# EAGLE design mikrophonie_2023 (EAGLE 9.6.2)

## Sheet 1 of 3
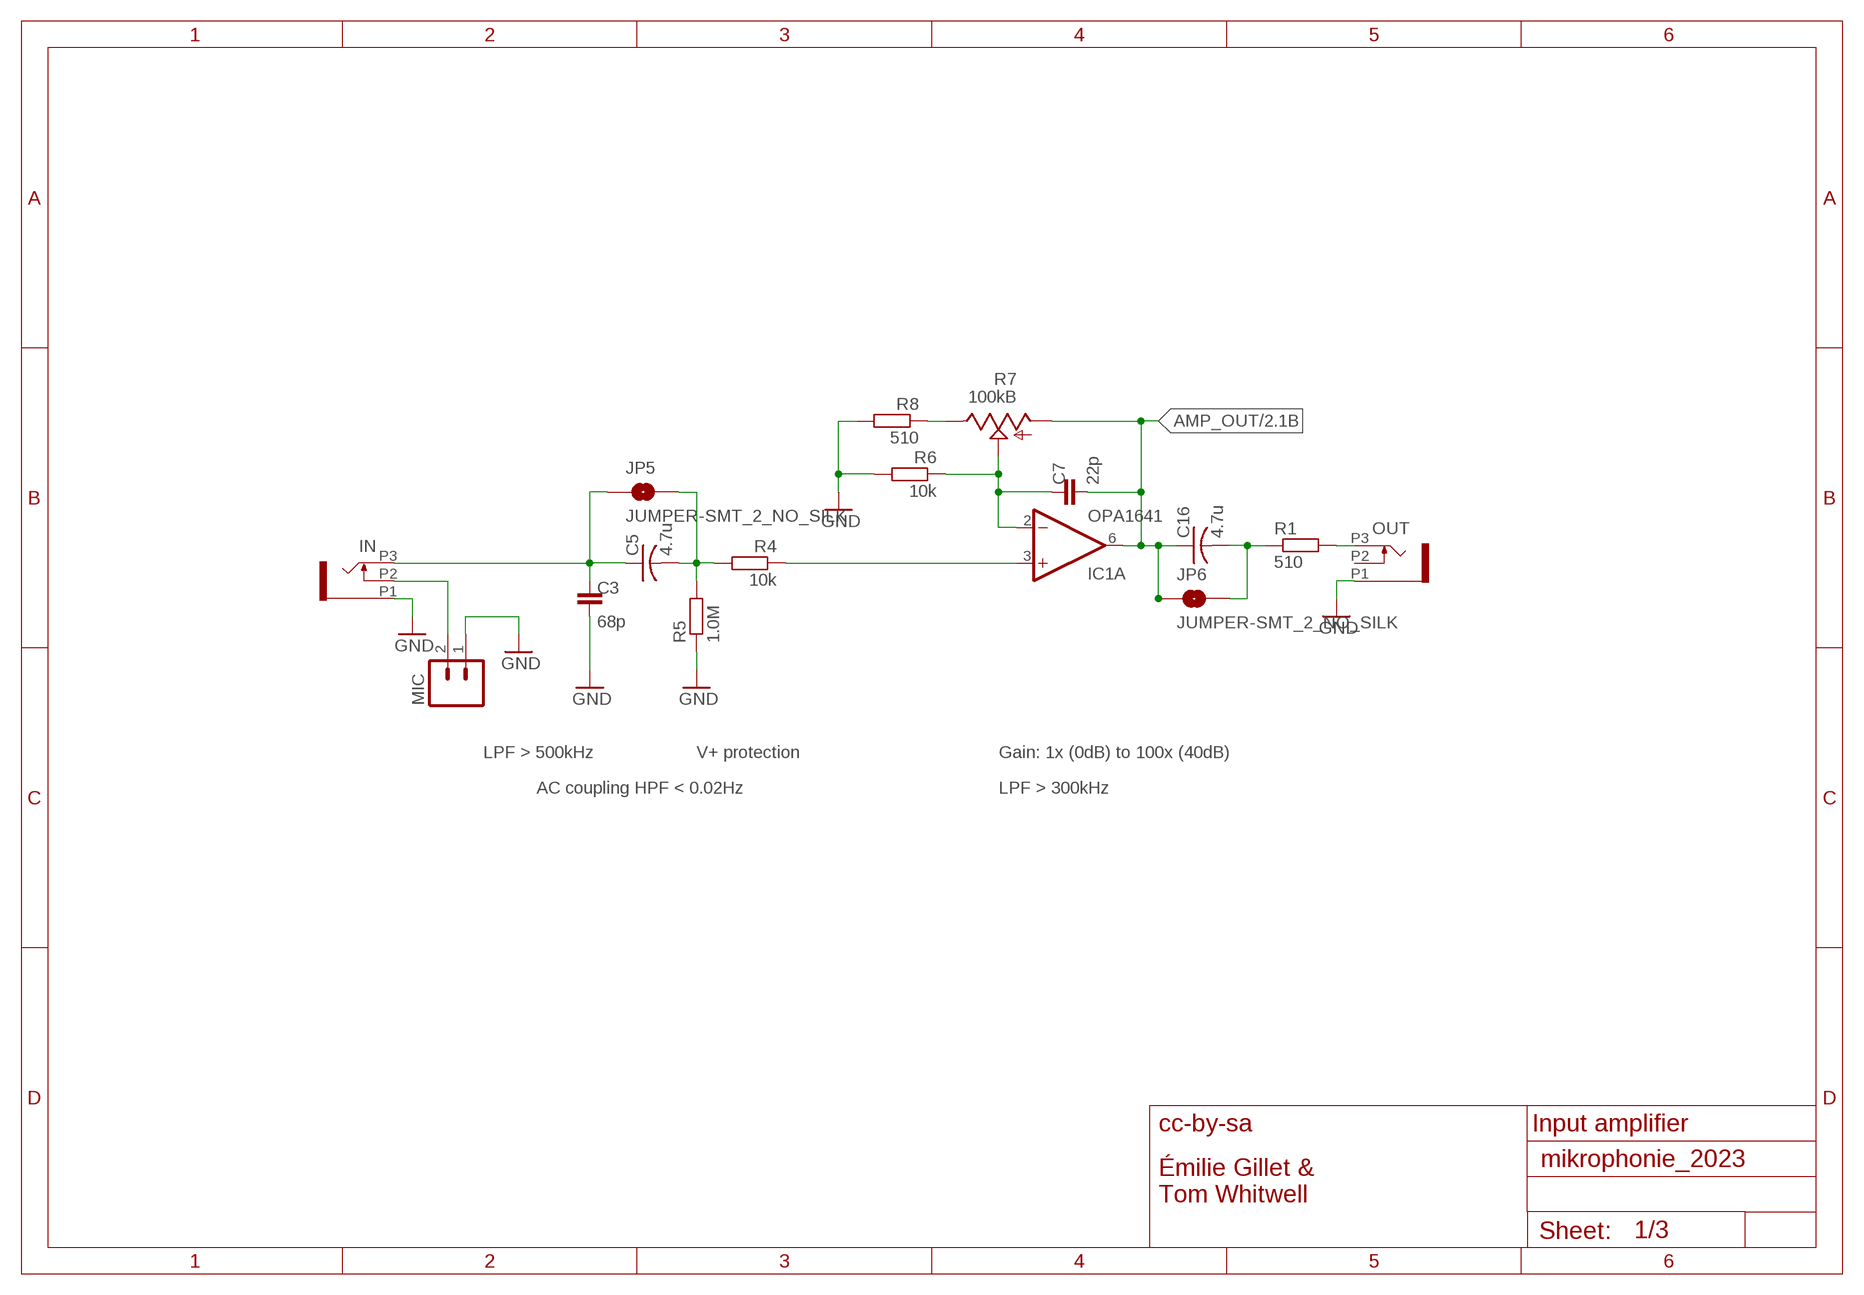
[diagram p0: schematic, sheet 1]

### Parts
C3  68p  CAPACITOR-90  [C0402-90]
C5  4.7u  C-USC0603  [C0603]
C7  22p  CAPACITOR-90  [C0402-90]
C16  4.7u  C-USC0603  [C0603]
IC1  OPA1641  [MSOP8]
IN  PJ301_THONKICONN6  [WQP_PJ_301M6]
JP5  JUMPER-SMT_2_NO_SILK  [SMT-JUMPER_2_NO_SILK]
JP6  JUMPER-SMT_2_NO_SILK  [SMT-JUMPER_2_NO_SILK]
MIC  M02TINY  [1X02_TINY]
OUT  PJ301_THONKICONN6  [WQP_PJ_301M6]
R1  510  RESISTOR-0402_90  [C0402-90]
R4  10k  RESISTOR-0402_90  [C0402-90]
R5  1.0M  RESISTOR-0402_90  [C0402-90]
R6  10k  RESISTOR-0402_90  [C0402-90]
R7  100kB  POT_USVERTICAL_PS  [ALPS_POT_VERTICAL_PS]
R8  510  RESISTOR-0402_90  [C0402-90]

### Nets
AMP_OUT: C7.2 C16.1 IC1.6(A:OUT) JP6.1 R7.P$3(A) ; also sheet 2
GND: C3.2 IN.P1 MIC.1 OUT.P1 R5.1 R6.2 R8.2 ; also sheet 2,3
N$2: IC1.3(A:+IN) R4.1
N$3: OUT.P3 R1.2
N$4: C3.1 C5.1 IN.P3 JP5.1
N$7: IN.P2 MIC.2
N$9: C7.1 IC1.2(A:-IN) R6.1 R7.P$2(S)
N$10: C5.2 JP5.2 R4.2 R5.2
N$13: R7.P$1(E) R8.1
N$15: C16.2 JP6.2 R1.1
Unconnected: OUT.P2

### Notes on the sheet
- LPF > 500kHz | V+ protection | Gain: 1x (0dB) to 100x (40dB)
- AC coupling HPF < 0.02Hz | LPF > 300kHz
- cc-by-sa | Input amplifier
- Émilie Gillet & 
  Tom Whitwell

## Sheet 2 of 3
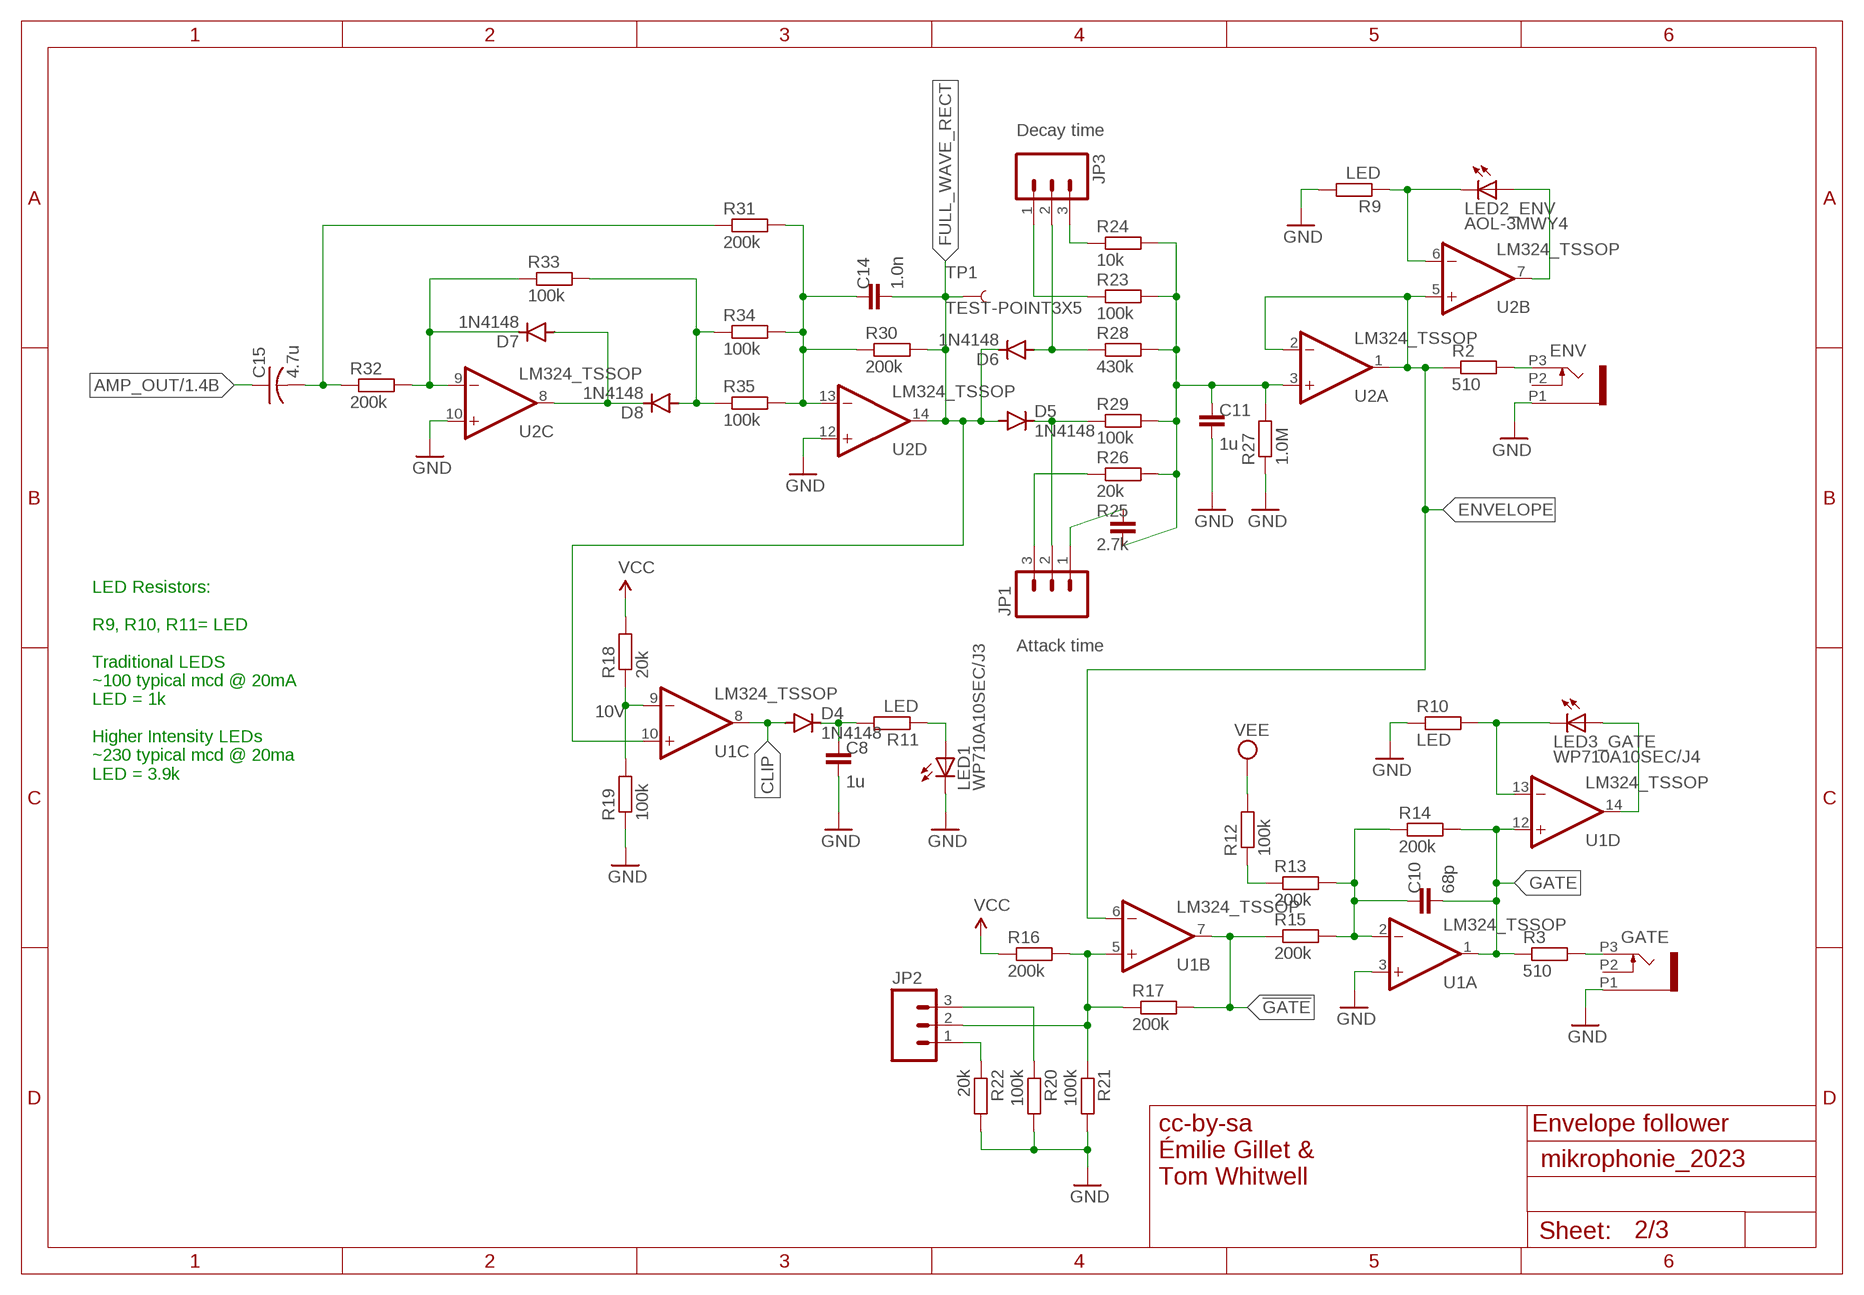
[diagram p1: schematic, sheet 2]

### Parts
C8  1u  CAPACITOR-90  [C0402-90]
C10  68p  CAPACITOR-90  [C0402-90]
C11  1u  CAPACITOR-90  [C0402-90]
C14  1.0n  CAPACITOR-90  [C0402-90]
C15  4.7u  C-USC0603  [C0603]
D4  1N4148  DIODE-SOD523  [SOD523]
D5  1N4148  DIODE-SOD523  [SOD523]
D6  1N4148  DIODE-SOD523  [SOD523]
D7  1N4148  DIODE-SOD523  [SOD523]
D8  1N4148  DIODE-SOD523  [SOD523]
ENV  PJ301_THONKICONN6  [WQP_PJ_301M6]
GATE  PJ301_THONKICONN6  [WQP_PJ_301M6]
JP1  M03PTH  [1X03]
JP2  M03PTH  [1X03]
JP3  M03PTH  [1X03]
LED1  WP710A10SEC/J3  LED3MM  [LED3MM]
LED2_ENV  AOL-3MWY4  LED3MM  [LED3MM]
LED3_GATE  WP710A10SEC/J4  LED3MM  [LED3MM]
R2  510  RESISTOR-0402_90  [C0402-90]
R3  510  RESISTOR-0402_90  [C0402-90]
R9  LED  RESISTOR-0402_90  [C0402-90]
R10  LED  RESISTOR-0402_90  [C0402-90]
R11  LED  RESISTOR-0402_90  [C0402-90]
R12  100k  RESISTOR-0402_90  [C0402-90]
R13  200k  RESISTOR-0402_90  [C0402-90]
R14  200k  RESISTOR-0402_90  [C0402-90]
R15  200k  RESISTOR-0402_90  [C0402-90]
R16  200k  RESISTOR-0402_90  [C0402-90]
R17  200k  RESISTOR-0402_90  [C0402-90]
R18  20k  RESISTOR-0402_90  [C0402-90]
R19  100k  RESISTOR-0402_90  [C0402-90]
R20  100k  RESISTOR-0402_90  [C0402-90]
R21  100k  RESISTOR-0402_90  [C0402-90]
R22  20k  RESISTOR-0402_90  [C0402-90]
R23  100k  RESISTOR-0402_90  [C0402-90]
R24  10k  RESISTOR-0402_90  [C0402-90]
R25  2.7k  CAPACITOR-90  [C0402-90]
R26  20k  RESISTOR-0402_90  [C0402-90]
R27  1.0M  RESISTOR-0402_90  [C0402-90]
R28  430k  RESISTOR-0402_90  [C0402-90]
R29  100k  RESISTOR-0402_90  [C0402-90]
R30  200k  RESISTOR-0402_90  [C0402-90]
R31  200k  RESISTOR-0402_90  [C0402-90]
R32  200k  RESISTOR-0402_90  [C0402-90]
R33  100k  RESISTOR-0402_90  [C0402-90]
R34  100k  RESISTOR-0402_90  [C0402-90]
R35  100k  RESISTOR-0402_90  [C0402-90]
TP1  TEST-POINT3X5  [PAD.03X.05]
U1  LM324_TSSOP  [SOP65P640X120-14N]
U2  LM324_TSSOP  [SOP65P640X120-14N]

### Nets
!GATE: R15.1 R17.2 U1.7(B:OUT)
AMP_OUT: C15.1 ; also sheet 1
AMP_OUT_AC: C15.2 R31.1 R32.1
CLIP: D4.A U1.8(C:OUT)
ENVELOPE: R2.1 U1.6(B:-IN) U2.1(A:OUT) U2.2(A:-IN) U2.5(B:+IN)
FULL_WAVE_RECT: C14.2 D5.A D6.C R30.2 TP1.P$1 U1.10(C:+IN) U2.14(D:OUT)
GATE: C10.2 R3.1 R14.2 U1.1(A:OUT) U1.12(D:+IN)
GND: C8.2 C11.2 ENV.P1 GATE.P1 LED1.K(C) R9.2 R10.1 R19.1 R20.2 R21.2 R22.2 R27.1 U1.3(A:+IN) U2.10(C:+IN) U2.12(D:+IN) ; also sheet 1,3
N$5: D7.A D8.C U2.8(C:OUT)
N$8: C10.1 R13.2 R14.1 R15.2 U1.2(A:-IN)
N$11: D7.C R32.2 R33.1 U2.9(C:-IN)
N$12: D8.A R33.2 R34.1 R35.1
N$14: C14.1 R30.1 R31.2 R34.2 R35.2 U2.13(D:-IN)
N$16: ENV.P3 R2.2
N$17: LED2_ENV.K(C) R9.1 U2.6(B:-IN)
N$18: D5.C JP1.2 R29.1
N$19: C11.1 R23.2 R24.2 R25.2 R26.2 R27.2 R28.2 R29.2 U2.3(A:+IN)
N$21: JP3.3 R24.1
N$23: JP3.1 R23.1
N$24: D6.A JP3.2 R28.1
N$25: JP1.1 R25.1
N$26: JP1.3 R26.1
N$27: R18.1 R19.2 U1.9(C:-IN)
N$28: C8.1 D4.C R11.2
N$30: LED2_ENV.A U2.7(B:OUT)
N$31: LED1.A R11.1
N$32: GATE.P3 R3.2
N$33: JP2.2 R16.2 R17.1 R21.1 U1.5(B:+IN)
N$35: JP2.1 R22.1
N$36: JP2.3 R20.1
N$37: LED3_GATE.K(C) R10.2 U1.13(D:-IN)
N$38: LED3_GATE.A U1.14(D:OUT)
N$39: R12.1 R13.1
VCC: R16.1 R18.2 ; also sheet 3
VEE: R12.2 ; also sheet 3
Unconnected: ENV.P2 GATE.P2

### Notes on the sheet
- Decay time
- LED Resistors: 
  
  R9, R10, R11= LED 
  
  Traditional LEDS
  ~100 typical mcd @ 20mA
  LED = 1k 
  
  Higher Intensity LEDs
  ~230 typical mcd @ 20ma
  LED = 3.9k
- Attack time
- 10V
- cc-by-sa | Envelope follower
- Émilie Gillet & 
  Tom Whitwell

## Sheet 3 of 3
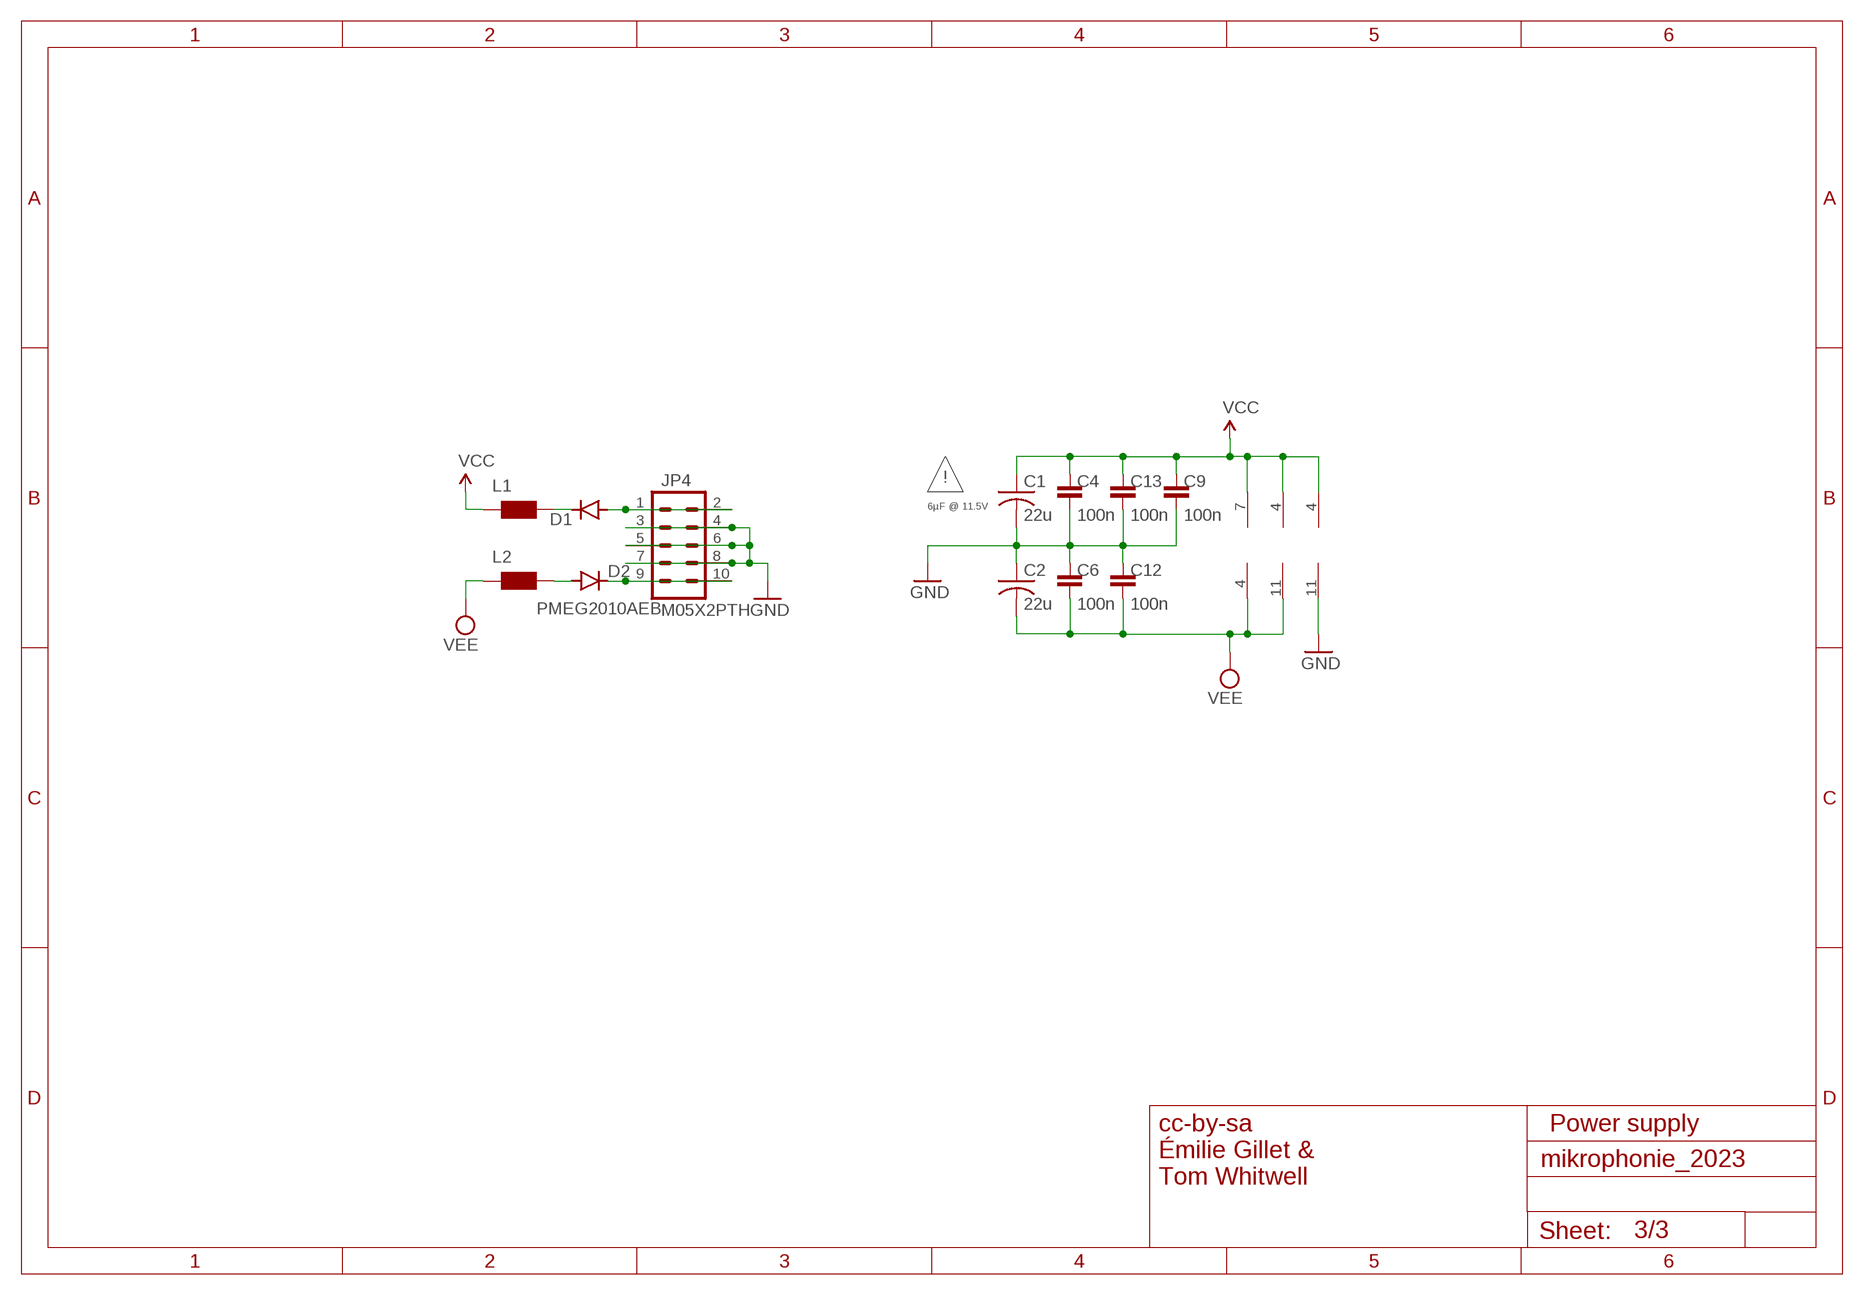
[diagram p2: schematic, sheet 3]

### Parts
C1  22u  C-USC1206  [C1206]
C2  22u  C-USC1206  [C1206]
C4  100n  CAPACITOR-90  [C0402-90]
C6  100n  CAPACITOR-90  [C0402-90]
C9  100n  CAPACITOR-90  [C0402-90]
C12  100n  CAPACITOR-90  [C0402-90]
C13  100n  CAPACITOR-90  [C0402-90]
D1  PMEG2010AEB  DIODE-SOD523  [SOD523]
D2  PMEG2010AEB  DIODE-SOD523  [SOD523]
JP4  M05X2PTH  [AVR_ICSP]
L1  WE-CBF_0603  [0603]
L2  WE-CBF_0603  [0603]

### Nets
GND: C1.2 C2.1 C4.2 C6.1 C9.2 C12.1 C13.2 JP4.3 JP4.4 JP4.5 JP4.6 JP4.7 JP4.8 U1.11(PWR:V-) ; also sheet 1,2
N$6: D1.A JP4.1 JP4.2
N$20: D2.C JP4.9 JP4.10
N$22: D1.C L1.2
N$44: D2.A L2.2
VCC: C1.1 C4.1 C9.1 C13.1 IC1.7(V+) L1.1 U1.4(PWR:V+) U2.4(PWR:V+) ; also sheet 2
VEE: C2.2 C6.2 C12.2 IC1.4(V-) L2.1 U2.11(PWR:V-) ; also sheet 2

### Notes on the sheet
- !
- 6µF @ 11.5V
- cc-by-sa | Power supply
- Émilie Gillet & 
  Tom Whitwell

## Library data of the parts
C1 C2 C5 C15 C16 = rcl:C-US: CAPACITOR, American symbol
C3 C4 C6-C14 R25 = we-rcl:CAPACITOR-90
D1 D2 D4-D8 = diode:DIODE-: DIODE
ENV GATE IN OUT = og-pj301:PJ301_THONKICONN
IC1 = og-ics:OPA1641
JP1-JP3 = SparkFun:M03: Header 3 Standard 3-pin 0.1" header. Use with straight break away headers (SKU : PRT-00116), right angle break away headers (PRT-00553), swiss pins (PRT-00743), machine pins (PRT-00117), and female headers (PRT-00115). Molex polarized connector foot print use with SKU : PRT-08232 with associated crimp pins and housings.
JP4 = og-header:M05X2: Header 5x2 Standard 10-pin dual row 0.1" header. Commonly used with AVR-ISP. Use with Spark Fun Electronics SKU: PRT-00778
JP5 JP6 = SparkFun-Jumpers:JUMPER-SMT_2_NO: Normally open jumper This jumper has two pads in close proximity to each other. Apply solder to close the connection. Round pads are easier to solder for beginners, but are a lot larger. SparkFun Product that uses the round pads: SparkFun EL Sequencer <https://www.sparkfun.com/products/12781>
L1 L2 = wuerth-elektronik:WE-CBF: SMD EMI Suppression Ferrite Beads - excellent anti-EMI properties - low DCR - impedances till 3000 ohms - rated current up to 6 A
LED1 LED2_ENV LED3_GATE = led:LED: LED OSRAM: - CHIPLED LG R971, LG N971, LY N971, LG Q971, LY Q971, LO R971, LY R971 LH N974, LH R974 LS Q976, LO Q976, LY Q976 LO Q996 - Hyper CHIPLED LW Q18S LB Q993, LB Q99A, LB R99A - SideLED LS A670, LO A670, LY A670, LG A670, LP A670 LB A673, LV A673, LT A673, LW A673 LH A674 LY A675 LS A676, LA A676, LO A676, LY A676, LW A676 LS A679, LY A679, LG A679 - Hyper Micro SIDELED® LS Y876, LA Y876, LO Y876, LY Y876 LT Y87S - SmartLED LW L88C, LW L88S LB L89C, LB L89S, LG L890 LS L89K, LO L89K, LY L89K LS L896, LA L896, LO L896, LY L896 - TOPLED LS T670, LO T670, LY T670, LG T670, LP T670 LSG T670, LSP T670, LSY T670, LOP T670, LYG T670 LG T671, LOG T671, LSG T671 LB T673, LV T673, LT T673, LW T673 LH T674 LS T676, LA T676, LO T676, LY T676, LB T676, LH T676, LSB T676, LW T676 LB T67C, LV T67C, LT T67C, LS T67K, LO T67K, LY T67K, LW E67C LS E67B, LA E67B, LO E67B, LY E67B, LB E67C, LV E67C, LT E67C LW T67C LS T679, LY T679, LG T679 LS T770, LO T770, LY T770, LG T770, LP T770 LB T773, LV T773, LT T773, LW T773 LH T774 LS E675, LA E675, LY E675, LS T675 LS T776, LA T776, LO T776, LY T776, LB T776 LHGB T686 LT T68C, LB T68C - Hyper Mini TOPLED® LB M676 - Mini TOPLED Santana® LG M470 LS M47K, LO M47K, LY M47K Source: http://www.osram.convergy.de LUXEON: - LUMILED® LXK2-PW12-R00, LXK2-PW12-S00, LXK2-PW14-U00, LXK2-PW14-V00 LXK2-PM12-R00, LXK2-PM12-S00, LXK2-PM14-U00 LXK2-PE12-Q00, LXK2-PE12-R00, LXK2-PE12-S00, LXK2-PE14-T00, LXK2-PE14-U00 LXK2-PB12-K00, LXK2-PB12-L00, LXK2-PB12-M00, LXK2-PB14-N00, LXK2-PB14-P00, LXK2-PB14-Q00 LXK2-PR12-L00, LXK2-PR12-M00, LXK2-PR14-Q00, LXK2-PR14-R00 LXK2-PD12-Q00, LXK2-PD12-R00, LXK2-PD12-S00 LXK2-PH12-R00, LXK2-PH12-S00 LXK2-PL12-P00, LXK2-PL12-Q00, LXK2-PL12-R00 Source: www.luxeon.com KINGBRIGHT: KA-3528ASYC Source: www.kingbright.com
MIC = og-header:M02: Header 2 Standard 2-pin 0.1" header. Use with straight break away headers (SKU : PRT-00116), right angle break away headers (PRT-00553), swiss pins (PRT-00743), machine pins (PRT-00117), and female headers (PRT-00115). Molex polarized connector foot print use with SKU : PRT-08233 with associated crimp pins and housings.
R1-R6 R8-R24 R26-R35 = we-rcl:RESISTOR: Resistors all kinds in 0402 and 0603
R7 = og-pots:POT_US
TP1 = SparkFun:TEST-POINT
U1 U2 = MTM_untested:LM324_TSSOP: IC OPAMP QUAD 1.8V; MPN: MCP6004-I/ST; OC_FARNELL: 8540861; OC_NEWARK: 72C4277; PACKAGE: 14TSSOP; SUPPLIER: Microchip

## Board
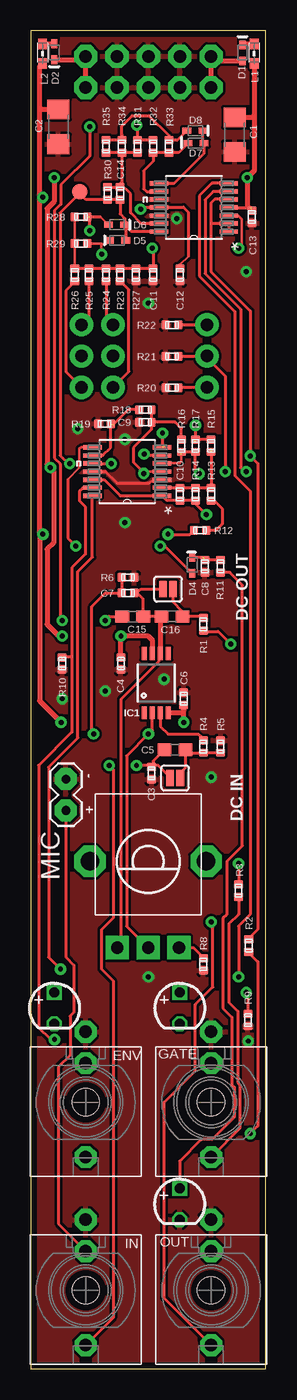
[diagram p3: board, top side]
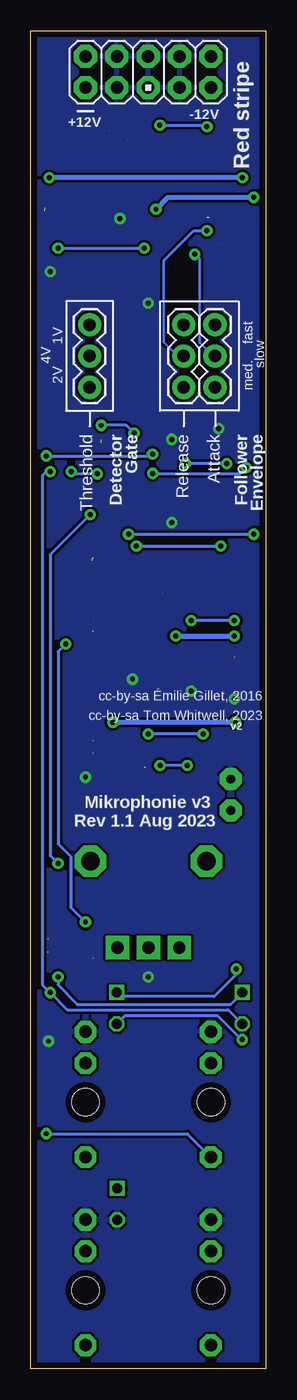
[diagram p4: board, bottom side, seen from below]

Size 19.03 x 108.43 mm. Coordinates in mm from the lower left corner, seen from the top.
Outline: 19.03,108.43 0,108.43 0,0 19.03,0 19.03,108.43
Copper layers (1*16): Top 0.035mm / dielectric 1.5mm / Bottom 0.035mm
Design rules "PCBCart-Standard *": minimum track width 8mil, minimum drill 0.4mm, track to track 8mil, track to pad 8mil, pad to pad 8mil, via to via 8mil, smd to smd 8mil, copper to edge 20mil, drill to drill 8mil, minimum pad ring 8mil, minimum via ring 10mil, stop-mask expansion 3mil, vias tented up to drill 25mil, thermal gap 8mil

### Footprints (pad centres in the part's own frame; a part is rotated, then mirrored left to right if it is on the bottom)
C1206 = smd 1.6 x 1.8: 1 -1.4,0; 2 1.4,0
C0402-90 = smd 0.7 x 0.75: 1 -0.5,0; 2 0.5,0
C0603 = smd 1.1 x 1: 1 -0.85,0; 2 0.85,0
SOD523 = smd 0.7 x 0.5: A 0.7,0; C -0.6,0
WQP_PJ_301M6 = drill 1.016 pad 1.778 octagon: P1 0,-5.715; P2 0,-3.175; P3 0,4.445 | hole 2.2: 0,0
MSOP8 = smd 0.41 x 1.02: 1 -0.975,-2.4; 2 -0.325,-2.4; 3 0.325,-2.4; 4 0.975,-2.4; 5 0.975,2.4; 6 0.325,2.4; 7 -0.325,2.4; 8 -0.975,2.4
1X03 = drill 1.016 pad 1.88: 1 0,0; 2 2.54,0; 3 5.08,0
AVR_ICSP = drill 1.016 pad 1.88 octagon: 1 -1.27,5.08; 2 1.27,5.08; 3 -1.27,2.54; 4 1.27,2.54; 5 -1.27,0; 6 1.27,0; 7 -1.27,-2.54; 8 1.27,-2.54; 9 -1.27,-5.08; 10 1.27,-5.08
SMT-JUMPER_2_NO_SILK = smd 0.635 x 1.27: 1 -0.406,0; 2 0.406,0
0603 = smd 0.85 x 0.7: 1 -0.9,0; 2 0.7,0
LED3MM = drill 0.813 square: A -1.27,0 | drill 0.813 octagon: K 1.27,0
1X02_TINY = drill 0.7 pad 1.778 octagon: 1 0,0; 2 2.54,0
ALPS_POT_VERTICAL_PS = drill 1 pad 1.88 square: P$1 -2.5,7; P$2 0,7; P$3 2.5,7 | drill 1.5 pad 2.54 octagon: P$4 -4.7,0; P$5 4.7,0
PAD.03X.05 = smd 1.27 x 1.27: P$1 0,0
SOP65P640X120-14N = smd 1.473 x 0.356: 1 -2.819,1.956; 2 -2.819,1.295; 3 -2.819,0.66; 4 -2.819,0; 5 -2.819,-0.66; 6 -2.819,-1.295; 7 -2.819,-1.956; 8 2.819,-1.956; 9 2.819,-1.295; 10 2.819,-0.66; 11 2.819,0; 12 2.819,0.66; 13 2.819,1.295; 14 2.819,1.956

### Placement (x,y rotation side)
C1  16.51,100.01 270 top
C2  2.22,100.65 90 top
C3  9.78,48.26 270 top
C4  7.3,57.15 270 top
C5  11.68,50.16 0 top
C6  12.38,54.29 270 top
C7  7.87,62.87 0 top
C8  14.1,65.02 270 top
C9  9.27,76.71 180 top
C10  12.06,70.87 270 top
C11  9.91,88.65 270 top
C12  12.06,88.65 90 top
C13  17.91,93.34 270 top
C14  7.24,95.25 270 top
C15  8.26,60.96 180 top
C16  11.43,60.96 0 top
D1  17.14,106.68 270 top
D2  1.91,106.68 90 top
D4  13.08,65.15 270 top
D5  6.99,91.44 0 top
D6  6.99,92.71 180 top
D7  13.34,99.31 0 top
D8  13.34,100.33 180 top
ENV  4.45,21.59 180 top
GATE  14.61,21.59 180 top
IC1  10.16,55.56 0 top
IN  4.45,6.35 180 top
JP1  4.11,84.61 270 bottom
JP2  14.27,84.61 270 bottom
JP3  6.65,79.53 90 bottom
JP4  9.53,105.09 90 bottom
JP5  11.68,47.88 0 top
JP6  11.11,63.18 0 top
L1  18.1,106.68 90 top
L2  0.95,106.68 90 top
LED1  12.04,13.34 270 top
LED2_ENV  1.91,29.21 270 top
LED3_GATE  12.06,29.21 270 top
MIC  2.84,47.78 270 top
OUT  14.61,6.35 180 top
R1  13.97,60.33 270 top
R2  17.65,34.29 270 top
R3  16.83,38.73 270 top
R4  13.97,50.42 270 top
R5  15.37,50.42 270 top
R6  7.87,64.14 0 top
R7  9.51,41.12 180 top
R8  13.97,32.77 270 top
R9  17.59,28.26 270 top
R10  2.54,57.15 90 top
R11  15.37,65.02 90 top
R12  13.72,67.94 180 top
R13  14.61,70.87 90 top
R14  13.34,70.87 270 top
R15  14.61,74.8 270 top
R16  12.19,74.8 270 top
R17  13.34,74.8 90 top
R18  9.27,77.72 0 top
R19  5.97,76.58 0 top
R20  11.43,79.5 180 top
R21  11.43,82.04 180 top
R22  11.43,84.58 180 top
R23  7.24,88.65 90 top
R24  6.1,88.65 90 top
R25  4.7,88.65 90 top
R26  3.56,88.65 90 top
R27  8.51,88.65 90 top
R28  4.06,93.34 180 top
R29  4.06,91.19 180 top
R30  6.22,95.25 270 top
R31  8.64,99.06 270 top
R32  9.91,99.06 270 top
R33  11.18,99.06 90 top
R34  7.37,99.06 270 top
R35  6.1,99.06 270 top
TP1  3.95,95.41 180 top
U1  7.81,72.71 180 top
U2  13.21,94.11 180 top

### Tracks (layer width: path | path; a pad name or v marks a point on that pad's centre or on a via)
!GATE  (via drill 0.4)  (2 unrouted)
  Top 0.203: 10.79,74.68 11.18,74.68 | 13.34,75.31 13.34,75.06
  Top 0.254: R15.1 R17.2 | U1.7 10.67,74.7 v10.67,75.82 | v13.34,76.45 13.34,75.31
  Bottom 0.254: v10.67,75.82 11.3,76.45 v13.34,76.45
AMP_OUT  (1 unrouted)
  Top 0.254: 10.48,60.87 C16.1 C15.1 9.11,62.4 8.62,62.88 | IC1.6 10.37,57.85 10.37,57.32 7.3,54.25 7.3,34.41 R7.P$3 | C7.2 8.62,62.88 | JP6.1 8.9,63.18 8.61,62.89 8.62,62.88
  Top 0.406: 10.48,60.87 IC1.6
AMP_OUT_AC  (via drill 0.4)
  Top 0.254: R32.1 R31.1 8.64,100.71 v8.57,100.78 | v4.76,100.65 4.76,98.28 2.42,95.94 2.42,94.38 1.91,93.86 1.91,73.82 2.37,73.35 2.37,60.81 v2.54,60.64 | v6.03,60.64 6.35,60.96 C15.2
  Bottom 0.254: v8.57,100.78 5.21,100.78 5.08,100.65 v4.76,100.65 | v2.54,60.64 v6.03,60.64
CLIP  (via drill 0.4)
  Top 0.203: 3,72.08 3.94,73.02 3.94,74.55 4.06,74.68 4.98,74.68 U1.8
  Top 0.254: v10.48,66.67 10.86,66.67 D4.A | v3.64,66.67 3,67.32 3,72.08
  Bottom 0.254: v10.48,66.67 v3.64,66.67
ENVELOPE  (via drill 0.4)  (1 unrouted)
  Top 0.254: U2.1 U2.2 14.62,92.81 14.59,92.84 | 17.62,34.83 18.39,35.61 18.39,73.36 v17.78,73.98 17.78,85.72 14.59,88.91 14.59,92.84 | U1.6 9.29,74 v9.17,74.13 | U2.5 14.88,94.77 14.59,94.47 14.59,92.84
  Bottom 0.254: v17.78,73.98 9.32,73.98 v9.17,74.13
FULL_WAVE_RECT  (via drill 0.4)
  Top 0.203: 7.68,92.61 D6.C 7.62,92.75
  Top 0.254: D5.A 7.68,92.61 8.14,92.15 U2.14 | TP1.P$1 3.95,95.26 | 3.95,95.26 2.36,93.67 2.36,74.01 3.03,73.34 v3.16,73.34 | U1.10 6.48,73.37 v6.51,73.34 | 3.95,95.26 4.46,94.75 R30.2 C14.2 7.24,93.6 7.62,93.22 7.62,92.75
  Bottom 0.254: v3.16,73.34 v6.51,73.34
GATE  (via drill 0.4)
  Top 0.254: R14.2 C10.2 11.02,70.37 U1.1 7.23,70.75 5.93,72.05 U1.12 | v16.83,40.96 R3.1 | R14.2 13.34,70.55 | v14.22,69.22 13.34,70.1 R14.2
  Bottom 0.254: v14.22,69.22 17.46,65.98 17.46,41.59 v16.83,40.96
GND  (via drill 0.4)
  Top 0.254: U1.11 6.03,72.71 6.99,71.75 9.59,71.75 9.76,71.92 9.94,71.92 10.07,72.05 U1.3
  other vias: 2.54,54.29 17.46,88.9 3.81,76.2 6.03,54.93 10.79,55.88 14.61,47.94 7.62,68.58 9.53,86.36 17.6,26.54 9.53,31.75 7.62,75.31 11.81,93.22
  pour Bottom: 20.93,0 20.93,108.43 -3.19,108.43 -3.19,0
  pour Top: 20.3,0 20.3,108.43 -1.93,108.43 -1.93,0
N$2  (1 unrouted)
  Top 0.254: 14.01,50.96 13.79,51.18 13.53,51.44 11.11,51.44 10.48,52.06 IC1.3
N$3  (via drill 0.4)  (1 unrouted)
  Top 0.254: 13.97,59.75 15.18,59.75 v16.19,58.74 | OUT.P3 10.79,5.71 10.79,21.59 13.34,24.13 13.34,29.52 14.75,30.93 14.75,36.05 v14.61,36.2
  Bottom 0.254: v16.19,58.74 16.83,58.1 16.83,42.55 15.8,41.52 15.8,37.4 v14.61,36.2
N$4  (via drill 0.4)  (4 unrouted)
  Top 0.254: 11.23,49.77 C5.1 9.91,49.24 9.91,48.92 9.97,48.92 | v6.35,48.9 6.67,48.58 6.67,36.51 5.71,35.56 5.71,32.38 6.67,31.43 6.67,4.13 IN.P3 | 9.93,48.76 C3.1 | 9.63,48.91 C3.1 | 9.79,48.74 9.97,48.92 | 9.97,48.92 10.29,48.92 11.28,47.93 JP5.1 | 9.77,48.76 9.77,48.9 v8.56,48.9
  Bottom 0.254: v6.35,48.9 v8.56,48.9
N$5
  Top 0.254: D8.C 13.94,99.41 D7.A 14.04,98.49 11.59,96.04 11.57,96.06 U2.8
N$6
  Top 0.406: D1.A 14.99,105.98 JP4.2 JP4.1
N$7
  Top 0.254: MIC.2 2.84,33.36 3.49,32.7 3.49,28.89 3.17,28.57 3.17,25.4 2.22,24.45 2.22,11.75 IN.P2
N$8  (2 unrouted)
  Top 0.254: C10.1 R14.1 R13.2 14.61,74.43 | U1.2 12.03,71.41
N$9  (via drill 0.4)
  Top 0.254: v5.08,51.44 4.93,51.58 4.93,61.77 6.03,62.87 C7.1 R6.1 | IC1.2 9.84,51.75 v9.53,51.44 7.76,49.67 7.76,35.86 R7.P$2
  Bottom 0.254: v5.08,51.44 v9.53,51.44
N$10  (1 unrouted)
  Top 0.254: R5.2 R4.2 | 13.97,49.84 12.86,49.84 C5.2 | 12.13,49.77 C5.2 | JP5.2 12.09,48.28 12.53,48.73 C5.2
N$11
  Top 0.254: U2.9 10.36,95.38 9.4,95.38 9.14,95.63 9.14,97.09 9.91,97.85 R32.2 R33.1 11.98,98.56 D7.C
N$12  (2 unrouted)
  Top 0.254: D8.A 12.26,99.96 12.25,99.96 11.85,99.56 R33.2 11.18,99.95 9.57,101.56 8.21,101.56 7.37,100.71 R34.1 | 7.37,100.01 R34.1 | R34.1 R35.1
N$13  (1 unrouted)
  Top 0.254: 14.01,33.3 13.2,34.12 R7.P$1
N$14
  Top 0.254: R31.2 R34.2 | R34.2 R35.2 | C14.1 7.37,95.88 R34.2 | R30.1 C14.1 | C14.1 7.24,96.06 8.08,95.21 8.08,93.68 8.95,92.81 U2.13
N$15  (1 unrouted)
  Top 0.254: R1.1 13.96,60.96 C16.2 12.28,61.38 11.52,62.14 JP6.2
N$16  (via drill 0.4)  (1 unrouted)
  Top 0.254: 17.62,33.75 18.39,32.97 18.39,19.66 v17.78,19.05
  Bottom 0.254: v17.78,19.05 6.35,19.05 ENV.P3
N$17  (via drill 0.4)
  Top 0.254: v17.46,72.71 17.31,72.71 17,73.02 17,85.86 14.11,88.75 14.11,94.74 14.77,95.4 U2.6 | v17.46,30.48 17.59,30.35 R9.1
  Bottom 0.254: v17.46,72.71 17.78,72.71 18.1,72.39 18.1,31.11 v17.46,30.48 16.07,29.08 3.05,29.08 LED2_ENV.K
N$18  (via drill 0.4)
  Top 0.203: D5.C 6.07,91.12 5.71,91.12 | R29.1 5.71,91.19 5.71,91.12 | v5.74,90.31 5.71,90.33 5.71,91.12
  Bottom 0.203: JP1.2 4.28,82.07 5.35,83.15 5.35,89.92 v5.74,90.31
N$19  (via drill 0.4)  (1 unrouted)
  Top 0.203: R28.2 R29.2 | 3.56,91.18 R26.2 | 17.03,93.21 17.07,93.17 17.07,91.05 v16.83,90.81
  Top 0.254: v9.84,90.81 9.91,90.74 C11.1 R27.2 R23.2 R24.2 R25.2 R26.2 | U2.3 16.79,93.45 17.03,93.21
  Bottom 0.254: v16.83,90.81 v9.84,90.81
N$20
  Top 0.406: JP4.9 JP4.10 4.16,106.08 D2.C
N$21
  Top 0.254: JP3.3 6.1,85.17 R24.1
N$22
  Top 0.406: D1.C 17.25,107.38 L1.2
N$23
  Top 0.254: JP3.1 7.94,80.82 7.94,87.45 R23.1
N$24  (via drill 0.4)  (1 unrouted)
  Top 0.203: D6.A 5.65,93.34
  Top 0.254: v4.76,92.23 4.76,93.33 | 5.65,93.34 R28.1
  Bottom 0.203: 8.26,89.79 8.26,83.19 7.14,82.07 JP3.2
  Bottom 0.254: 8.26,89.79 5.81,92.23 v4.76,92.23
N$25
  Top 0.254: R25.1 4.7,85.2 JP1.1
N$26
  Top 0.254: JP1.3 2.84,80.8 2.84,87.36 3.56,88.08 R26.1
N$27  (1 unrouted)
  Top 0.254: U1.9 5.03,74.04 5.84,74.04 6.47,74.67 R19.2 | R18.1 7.87,77.72 6.68,76.53
N$28  (1 unrouted)
  Top 0.254: 13.98,65.75 D4.C | R11.2 C8.1
N$30  (via drill 0.4)
  Top 0.254: v16.83,31.75 16.83,35.88 17.78,36.83 17.78,71.12 16.54,72.36 16.54,85.67 13.65,88.56 13.65,95.06 14.66,96.06 U2.7
  Bottom 0.254: v16.83,31.75 16.83,31.11 15.25,29.54 2.85,29.54 LED2_ENV.A
N$31
  Top 0.254: LED1.A 12.04,16.81 13.82,18.59 14.69,18.59 16.48,20.38 16.48,22.8 16.28,23 16.28,28.49 15.56,29.21 15.56,36.51 15.88,36.83 15.88,41.11 17.14,42.38 17.14,63.5 16.12,64.52 R11.1
N$32
  Top 0.254: R3.2 16.83,36.83 16.04,36.05 16.04,29.68 16.76,28.96 16.76,23.17 16.94,22.99 16.94,19.48 GATE.P3
N$33  (via drill 0.4)  (1 unrouted)
  Top 0.203: U1.5 10.67,73.41 12.06,73.41 12.19,73.53 12.19,74.03
  Top 0.254: R21.1 14.24,82.04 JP2.2 14.27,81.94 15.76,80.44 15.76,72.72 v15.75,72.71 | v13.65,72.53 13.34,72.85 R17.1 R16.2
  Bottom 0.254: v15.75,72.71 15.58,72.53 v13.65,72.53
N$35
  Top 0.254: R22.1 14.24,84.58 JP2.1
N$36
  Top 0.254: R20.1 14.24,79.5 JP2.3
N$37  (via drill 0.4)  (3 unrouted)
  Top 0.254: v1.92,26.67 1.6,26.67 0.64,27.63 0.64,48.9 3.32,51.58 3.32,57.73 | 2.53,57.65 2.53,57.8 | R10.2 2.53,57.78 | 3.32,57.73 3.32,64.92 4.43,66.02 4.43,69.85 3.92,70.35 3.92,71.11 4.19,71.37 4.95,71.37 U1.13 | 2.54,57.73 3.32,57.73
  Bottom 0.254: v1.92,26.67 1.96,26.67 3.87,28.57 11.43,28.57 LED3_GATE.K
N$38  (via drill 0.4)
  Top 0.254: v2.4,32.38 1.45,33.34 1.45,48.76 3.81,51.12 3.81,64.6 4.99,65.78 U1.14
  Bottom 0.254: v2.4,32.38 2.4,31.95 4.19,30.16 11.75,30.16 LED3_GATE.A
N$39
  Top 0.254: R13.1 14.85,70.37 15.49,69.72 15.49,68.45 14.99,67.94 R12.1
N$44
  Top 0.406: L2.2 D2.A
VCC  (via drill 0.4)  (1 unrouted)
  Top 0.203: U1.4 9.29,72.71
  Top 0.254: 9.29,72.71 v9.14,72.56 9.14,72.61 8.3,73.46 8.3,74.64 9.77,76.11 C9.1 | 9.89,77.72 R18.2 | U2.4 17.85,94.11 | R18.2 9.79,77.71 | R18.2 C9.1 | R16.1 12.19,76.2 11.68,76.71 C9.1
  Top 0.406: 1.81,96.52 v1.89,96.52 1.89,94.6 1.32,94.03 1.32,73.29 v1.59,73.03 1.59,72.97 1.84,72.72 1.84,66.93 1.32,66.41 1.32,60.33 2.27,59.37 v2.54,59.37 | C4.1 v7.3,59.37 9.53,59.37 9.84,59.06 IC1.7 | L1.1 18.1,101.6 | 18.1,101.6 18.1,97.08 v17.54,96.52 17.54,94.21 C13.1 | C1.1 17.91,101.41 18.1,101.6
  Bottom 0.254: v9.14,72.56 2.05,72.56 v1.59,73.03
  Bottom 0.406: v1.89,96.52 v17.54,96.52 | v7.3,59.37 v2.54,59.37
VEE  (via drill 0.4)
  Top 0.203: C12.2 12.06,89.47 12.78,90.19
  Top 0.254: 12.78,90.19 12.78,93.71 12.35,94.14 10.42,94.14 U2.11 9.08,94.11 9.05,94.14 v8.89,93.98 | v11.11,67.63 11.13,67.61 12.88,67.61 R12.2 | v0.98,67.63 0.71,67.63
  Top 0.406: 2.41,102.05 C2.2 0.9,102.05 0.71,102.23 | 0.71,94.93 0.71,67.63 0.71,54.12 v2.45,52.39 | 0.71,94.93 v0.96,94.93 | v12.38,52.39 C6.2 12.38,53.32 12.23,53.16 IC1.4 | L2.1 0.71,105.54 0.71,102.23 | 0.71,94.93 0.71,102.23
  Bottom 0.254: v11.11,67.63 v0.98,67.63
  Bottom 0.406: v0.96,94.93 7.94,94.93 v8.89,93.98 | v2.45,52.39 v12.38,52.39

### Text on the board
tPlace: DC OUT | - | + | DC IN
bPlace: Red stripe | fast | slow | 1V | med. | 4V | 2V | Envelope | Follower | Attack | Release | Gate | Detector | Threshold
bNames: -12V | +12V | cc-by-sa Émilie Gillet, 2016 | cc-by-sa Tom Whitwell, 2023 | v2 | Mikrophonie v3 / Rev 1.1 Aug 2023